# EAGLE design PiHat (EAGLE 9.2.2)

## Sheet 1 of 2
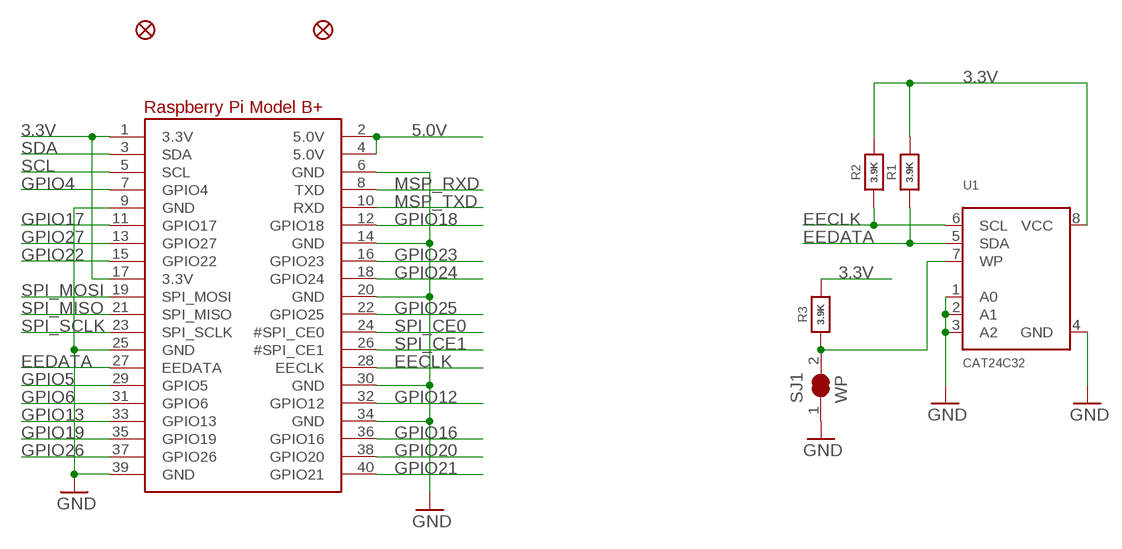
[diagram p0: schematic, sheet 1]

### Parts
FID2  FIDUCIAL""  [FIDUCIAL_1MM]
FID3  FIDUCIAL""  [FIDUCIAL_1MM]
R1  3.9K  RESISTOR0805_NOOUTLINE  [0805-NO]
R2  3.9K  RESISTOR0805_NOOUTLINE  [0805-NO]
R3  3.9K  RESISTOR0805_NOOUTLINE  [0805-NO]
RPI1  RASPBERRYPI_BPLUS_HATNOSLOTS  [PI_HAT_NOSLOTS]
SJ1  WP  SOLDERJUMPER_CLOSED  [SOLDERJUMPER_CLOSEDWIRE]
U1  CAT24C32  EEPROM_I2C_SOIC8_GENERIC  [SOIC8_150MIL]

### Nets
3.3V: R1.2 R2.2 R3.2 RPI1.1(3.3V) RPI1.17(3.3V) U1.8(VCC)
5.0V: RPI1.2(5.0V) RPI1.4(5.0V) ; also sheet 2
EECLK: R2.1 RPI1.28(EECLK) U1.6(SCL)
EEDATA: R1.1 RPI1.27(EEDATA) U1.5(SDA)
GND: RPI1.6(GND) RPI1.9(GND) RPI1.14(GND) RPI1.20(GND) RPI1.25(GND) RPI1.30(GND) RPI1.34(GND) RPI1.39(GND) SJ1.1 U1.1(A0) U1.2(A1) U1.3(A2) U1.4(GND) ; also sheet 2
GPIO4: RPI1.7(GPIO4)
GPIO5: RPI1.29(GPIO5)
GPIO6: RPI1.31(GPIO6)
GPIO12: RPI1.32(GPIO12)
GPIO13: RPI1.33(GPIO13)
GPIO16: RPI1.36(GPIO16) ; also sheet 2
GPIO17: RPI1.11(GPIO17) ; also sheet 2
GPIO18: RPI1.12(GPIO18) ; also sheet 2
GPIO19: RPI1.35(GPIO19) ; also sheet 2
GPIO20: RPI1.38(GPIO20)
GPIO21: RPI1.40(GPIO21)
GPIO22: RPI1.15(GPIO22)
GPIO23: RPI1.16(GPIO23)
GPIO24: RPI1.18(GPIO24) ; also sheet 2
GPIO25: RPI1.22(GPIO25) ; also sheet 2
GPIO26: RPI1.37(GPIO26) ; also sheet 2
GPIO27: RPI1.13(GPIO27) ; also sheet 2
MSP_RXD: RPI1.8(TXD) ; also sheet 2
MSP_TXD: RPI1.10(RXD) ; also sheet 2
N$16: R3.1 SJ1.2 U1.7(WP)
SCL: RPI1.5(SCL)
SDA: RPI1.3(SDA)
SPI_CE0: RPI1.24(#SPI_CE0)
SPI_CE1: RPI1.26(#SPI_CE1)
SPI_MISO: RPI1.21(SPI_MISO)
SPI_MOSI: RPI1.19(SPI_MOSI)
SPI_SCLK: RPI1.23(SPI_SCLK)

## Sheet 2 of 2
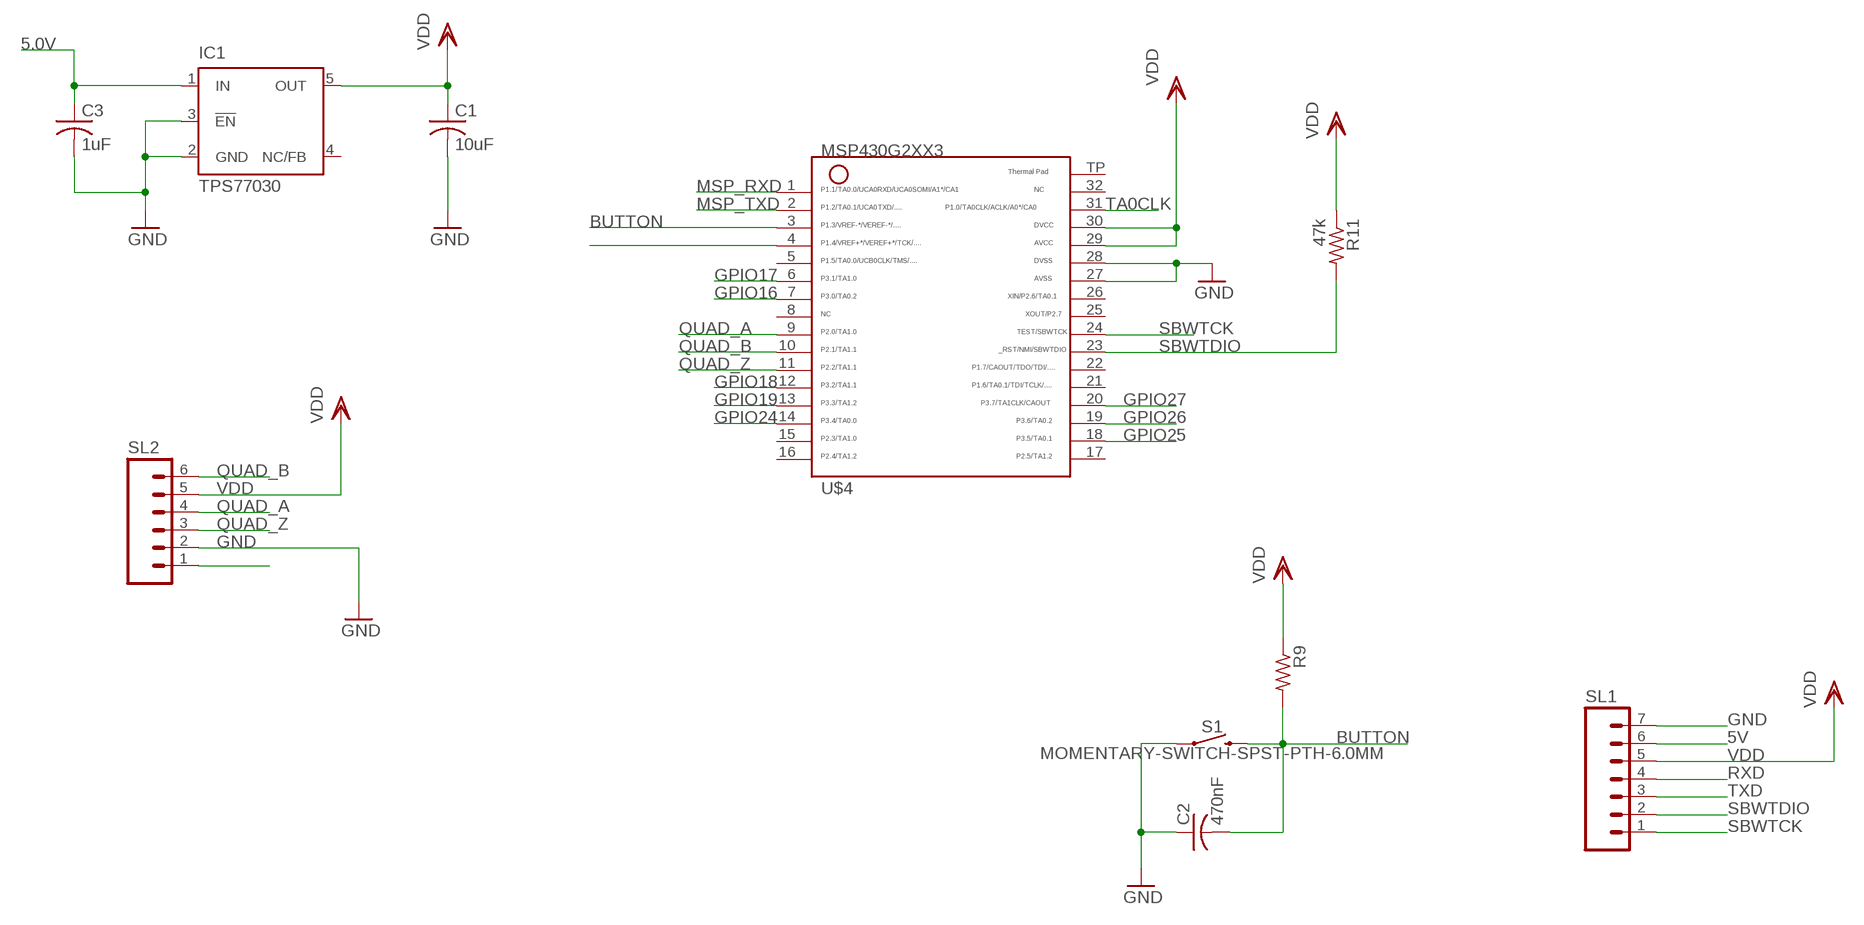
[diagram p1: schematic, sheet 2]

### Parts
C1  10uF  C-USC1206  [C1206]
C2  470nF  C-USC1206  [C1206]
C3  1uF  C-USC0603  [C0603]
IC1  TPS77030  [SOT23-DBV]
R9  R-US_R1206  [R1206]
R11  47k  R-US_R1206  [R1206]
S1  MOMENTARY-SWITCH-SPST-PTH-6.0MM  [TACTILE_SWITCH_PTH_6.0MM]
SL1  M07  [07P]
SL2  M06  [06P]
U$4  G2XX3---RHB32  [RHB32]

### Nets
5.0V: C3.1 IC1.1(IN) ; also sheet 1
5V: SL1.6
BUTTON: C2.2 R9.2 S1.3 U$4.3
GND: C1.2 C2.1 C3.2 IC1.2(GND) IC1.3(!EN) S1.1 SL1.7 SL2.2 U$4.27 U$4.28 ; also sheet 1
GPIO16: U$4.7 ; also sheet 1
GPIO17: U$4.6 ; also sheet 1
GPIO18: U$4.12 ; also sheet 1
GPIO19: U$4.13 ; also sheet 1
GPIO24: U$4.14 ; also sheet 1
GPIO25: U$4.18 ; also sheet 1
GPIO26: U$4.19 ; also sheet 1
GPIO27: U$4.20 ; also sheet 1
MSP_RXD: U$4.1 ; also sheet 1
MSP_TXD: U$4.2 ; also sheet 1
N$6: SL2.1
N$24: U$4.4
QUAD_A: SL2.4 U$4.9
QUAD_B: SL2.6 U$4.10
QUAD_Z: SL2.3 U$4.11
RXD: SL1.4
SBWTCK: SL1.1 U$4.24
SBWTDIO: R11.2 SL1.2 U$4.23
TA0CLK: U$4.31
TXD: SL1.3
VDD: C1.1 IC1.5(OUT) R9.1 R11.1 SL1.5 SL2.5 U$4.29 U$4.30
Unconnected: IC1.4(NC/FB) U$4.5 U$4.8 U$4.15 U$4.16 U$4.17 U$4.21 U$4.22 U$4.25 U$4.26 U$4.32 U$4.TP

## Library data of the parts
C1-C3 = rcl:C-US: CAPACITOR, American symbol; SPICEPREFIX: C
FID2 FID3 = microbuilder:FIDUCIAL: Fiducial Alignment Points Various fiducial points for machine vision alignment.; BOM: EXCLUDE
IC1 = texas:TPS770*: ULTRALOW-POWER 50-mA LOW-DROPOUT LINEAR REGULATORS 50-mA Low-Dropout Regulator Source: http://focus.ti.com/lit/ds/symlink/tps77001.pdf; MF: TEXAS INSTRUMENTS; MPN: TPS77030DBVT; OC_FARNELL: 1207348; OC_NEWARK: 77C1185
R1-R3 = microbuilder:RESISTOR: Resistors For new designs, use the packages preceded by an '_' character since they are more reliable: The following footprints should be used on most boards: _0402 - Standard footprint for regular board layouts _0603 - Standard footprint for regular board layouts _0805 - Standard footprint for regular board layouts _1206 - Standard footprint for regular board layouts For extremely tight-pitch boards where space is at a premium, the following 'micro-pitch' footprints can be used (smaller pads, no silkscreen outline, etc.): _0402MP - Micro-pitch footprint for very dense/compact boards _0603MP - Micro-pitch footprint for very dense/compact boards _0805MP - Micro-pitch footprint for very dense/compact boards _1206MP - Micro-pitch footprint for very dense/compact boards
R9 R11 = rcl:R-US_: RESISTOR, American symbol; SPICEPREFIX: R
RPI1 = microbuilder:RASPBERRYPI_BPLUS
S1 = SparkFun-Switches:MOMENTARY-SWITCH-SPST: Momentary Switch (Pushbutton) - SPST Normally-open (NO) SPST momentary switches (buttons, pushbuttons). Variants PTH-12MM - 12mm square, through-hole Momentary Pushbutton Switch - 12mm Square <https://www.sparkfun.com/products/9190> (COM-09190) PTH-6.0MM, PTH-6.0MM-KIT - 6.0mm square, through-hole Mini Pushbutton Switch <https://www.sparkfun.com/products/97> (COM-00097) KIT package intended for soldering kit's - only one side of pads' copper is exposed. PTH-RIGHT-ANGLE-KIT - Right-angle, through-hole Right Angle Tactile Button <https://www.sparkfun.com/products/10791> - Used on SparkFun BigTime Watch Kit <https://www.sparkfun.com/products/11734> SMD-12MM - 12mm square, surface-mount Tactile Button - SMD (12mm) <https://www.sparkfun.com/products/12993> (COM-12993) Used on SparkFun PicoBoard <https://www.sparkfun.com/products/11888> SMD-4.5MM - 4.5mm Square Trackball Switch Used on SparkFun Blackberry Trackballer Breakout <https://www.sparkfun.com/products/13169> SMD-4.6MMX2.8MM - 4.60mm x 2.80mm, surface mount Used on SparkFun SAMD21 Mini Breakout <https://www.sparkfun.com/products/13664> SMD-5.2MM, SMD-5.2-REDUNDANT - 5.2mm square, surface-mount Mini Pushbutton Switch - SMD <https://www.sparkfun.com/products/8720> (COM-08720) Used on Arduino Pro Mini <https://www.sparkfun.com/products/11114> REDUNDANT package connects both switch circuits together SMD-6.0X3.5MM - 6.0 x 3.5mm, surface mount Momentary Reset Switch SMD <https://www.sparkfun.com/products/8229> (COM-08229) SMD-6.2MM-TALL - 6.2mm square, surface mount Tactile Button - SMD (6mm) <https://www.sparkfun.com/products/12992> Used on SparkFun Digital Sandbox <https://www.sparkfun.com/products/12651> SMD-RIGHT-ANGLE - Right-angle, surface mount Used on SparkFun Block for Intel® Edison - Arduino <https://www.sparkfun.com/products/13036>; PROD_ID: SWCH-08441; SF_SKU: COM-00097
SJ1 = microbuilder:SOLDERJUMPER_CLOSED: Solder Jumper - Closed These solder jumpers are closed by default CLOSEDWIRE - 10 mil trace between pads that can be cut and resoldered later CLOSEDPERM - 63 mil trace between pads for a permanent connection (used to 'bridge' two signals, a shameless hack for Eagle). Can double as a test point as well (no cream layer)
SL1 = con-amp-quick:M07: AMP QUICK CONNECTOR; OC_FARNELL: unknown; OC_NEWARK: unknown
SL2 = con-amp-quick:M06: AMP QUICK CONNECTOR; OC_FARNELL: unknown; OC_NEWARK: unknown
U1 = microbuilder:EEPROM_I2C_SOIC8_GENERIC: Note: The same pinout is used for many I2C EEPROMs in SOIC8(150mil) from a variety of manufacturers and in various sizes. Examples: 16K (2K x 8 Bit) I2C EEPROM 1.7-5.5V, 400KHz, -40°C-85°C Digikey: CAT24C16WI-GT3CT-ND 256K (32K x 8 Bit) I2C EEPROM 1.7-5.5V, 400KHz, -40°C-85°C Digikey: 24AA256-I/SN-ND
U$4 = TI_MSP430_v16:G2XX3---RHB32: MSP430G2XX1 QFN (RHB) 32 Pin Package

## Board
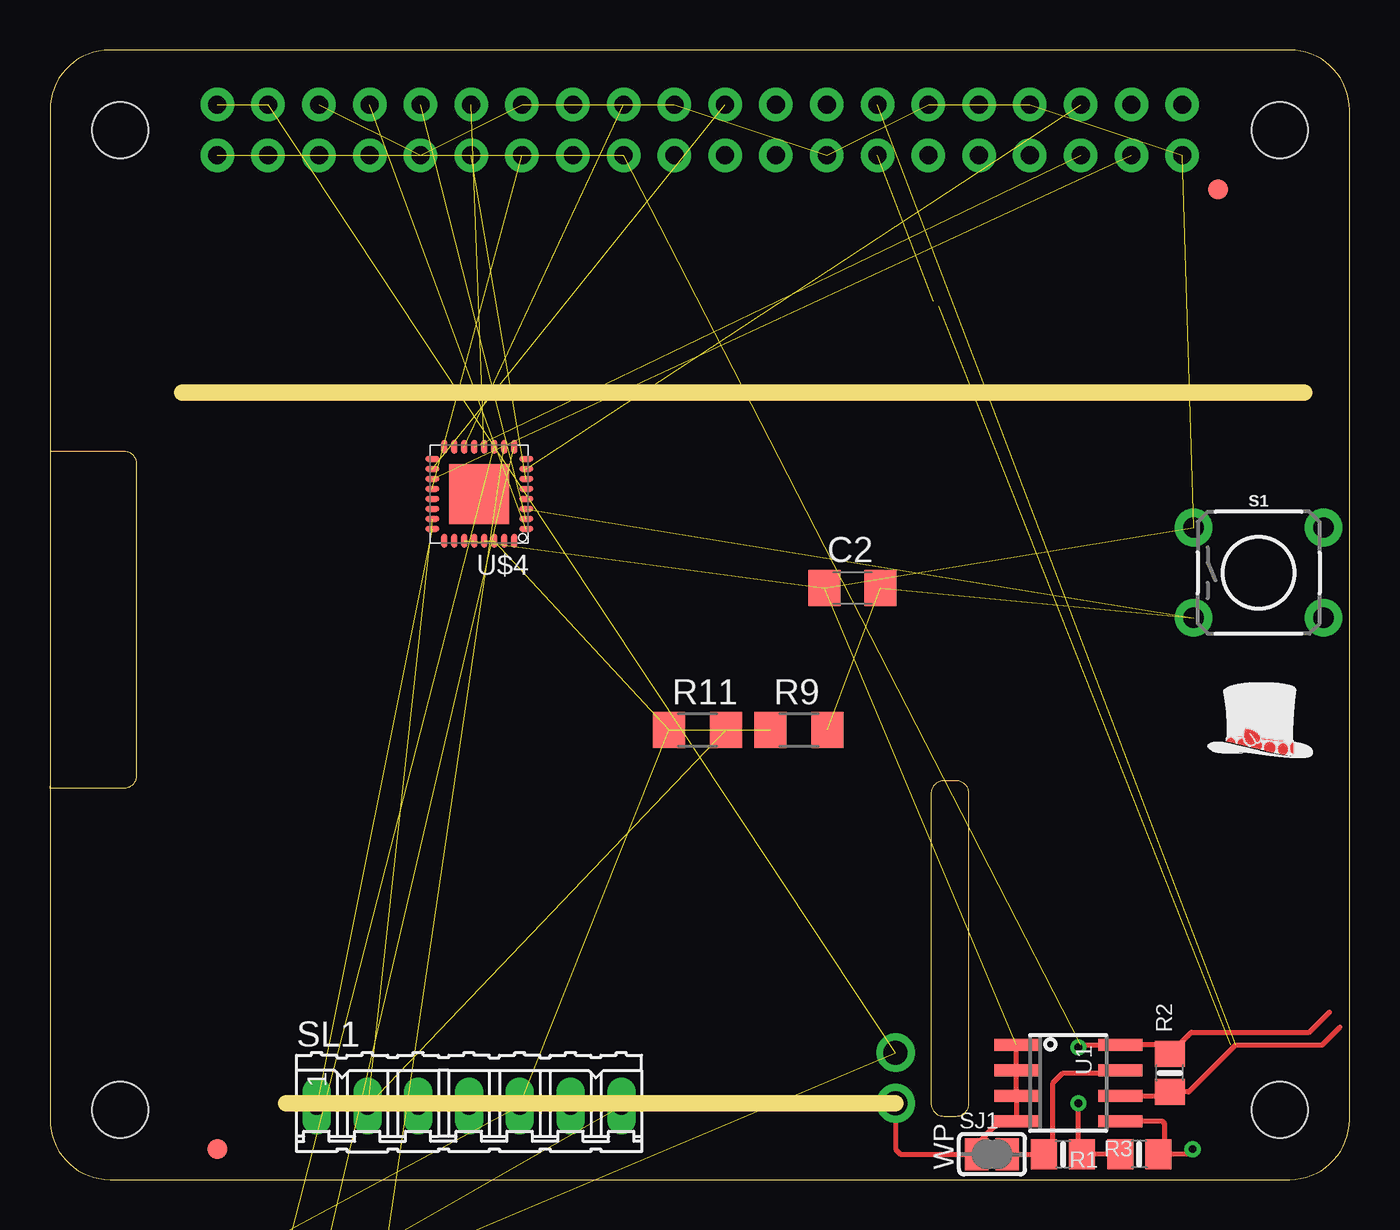
[diagram p2: board, top side]
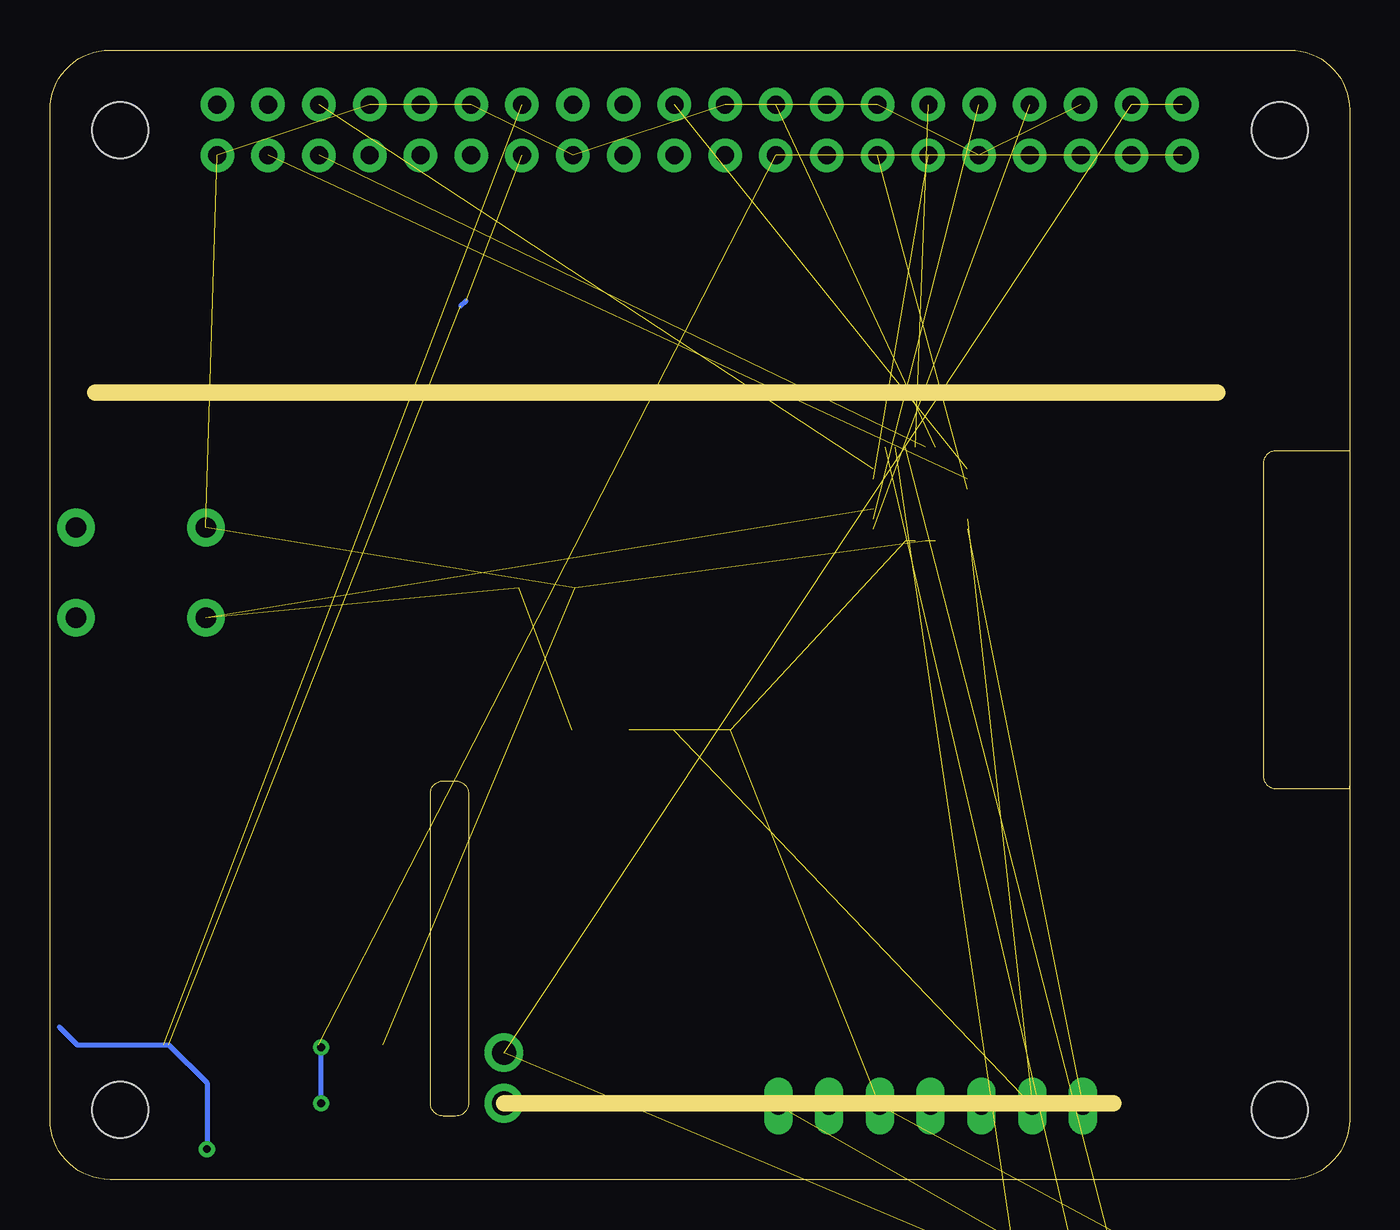
[diagram p3: board, bottom side, seen from below]

Size 65 x 56.5 mm. Coordinates in mm from the lower left corner, seen from the top.
Outline: 0,36.45 3.68,36.45 arc-90 4.32,35.81 4.32,20.19 arc-90 3.68,19.56 0,19.56 0,19.68
Outline: 44.7,3.17 45.34,3.17 arc90 45.97,3.81 45.97,19.3 arc90 45.34,19.94 44.7,19.94 arc90 44.07,19.3 44.07,3.81 arc90 44.7,3.17
Copper layers (1*16): Top 0.035mm / dielectric 1.5mm / Bottom 0.035mm
Design rules "adafruit *": minimum track width 8mil, minimum drill 15.5mil, track to track 8mil, track to pad 8mil, pad to pad 8mil, via to via 8mil, smd to smd 8mil, copper to edge 10mil, drill to drill 8mil, minimum pad ring 10mil, minimum via ring 8mil, stop-mask expansion 2mil, vias tented up to drill 20mil, thermal gap 10mil
Milling: 2 lines

### Footprints (pad centres in the part's own frame; a part is rotated, then mirrored left to right if it is on the bottom)
C1206 = smd 1.6 x 1.8: 1 -1.4,0; 2 1.4,0
C0603 = smd 1.1 x 1: 1 -0.85,0; 2 0.85,0
FIDUCIAL_1MM = smd 1 x 1: 1 0,0
SOT23-DBV = smd 0.55 x 1.2: 1 -0.95,-1.3; 2 0,-1.3; 3 0.95,-1.3; 4 0.95,1.3; 5 -0.95,1.3
0805-NO = smd 1.3 x 1.5: 1 -0.95,0; 2 0.95,0
R1206 = smd 1.6 x 1.803: 1 -1.422,0; 2 1.422,0
PI_HAT_NOSLOTS = drill 0.9 pad 1.676: 1 8.37,51.23; 2 8.37,53.77; 3 10.91,51.23; 4 10.91,53.77; 5 13.45,51.23; 6 13.45,53.77; 7 15.99,51.23; 8 15.99,53.77; 9 18.53,51.23; 10 18.53,53.77; 11 21.07,51.23; 12 21.07,53.77; 13 23.61,51.23; 14 23.61,53.77; 15 26.15,51.23; 16 26.15,53.77; 17 28.69,51.23; 18 28.69,53.77; 19 31.23,51.23; 20 31.23,53.77; 21 33.77,51.23; 22 33.77,53.77; 23 36.31,51.23; 24 36.31,53.77; 25 38.85,51.23; 26 38.85,53.77; 27 41.39,51.23; 28 41.39,53.77; 29 43.93,51.23; 30 43.93,53.77; 31 46.47,51.23; 32 46.47,53.77; 33 49.01,51.23; 34 49.01,53.77; 35 51.55,51.23; 36 51.55,53.77; 37 54.09,51.23; 38 54.09,53.77; 39 56.63,51.23; 40 56.63,53.77 | hole 2.8: 3.5,3.5; 3.5,52.5; 61.5,52.5; 61.5,3.5
TACTILE_SWITCH_PTH_6.0MM = drill 1.016 pad 1.88: 1 -3.251,2.261; 2 3.251,2.261; 3 -3.251,-2.261; 4 3.251,-2.261
SOLDERJUMPER_CLOSEDWIRE = smd 1.168 x 1.6: 1 -0.762,0; 2 0.762,0 | smd 0.635 x 0.203: WIRE 0,0
07P = drill 0.914 long: 1 -7.62,0; 2 -5.08,0; 3 -2.54,0; 4 0,0; 5 2.54,0; 6 5.08,0; 7 7.62,0
06P = drill 0.914 long: 1 -6.35,0; 2 -3.81,0; 3 -1.27,0; 4 1.27,0; 5 3.81,0; 6 6.35,0
SOIC8_150MIL = smd 0.6 x 2.2: 1 -1.905,-2.6; 2 -0.635,-2.6; 3 0.635,-2.6; 4 1.905,-2.6; 5 1.905,2.6; 6 0.635,2.6; 7 -0.635,2.6; 8 -1.905,2.6
RHB32 = smd 0.7 x 0.3: 1 -2.35,1.75; 2 -2.35,1.25; 3 -2.35,0.75; 4 -2.35,0.25; 5 -2.35,-0.25; 6 -2.35,-0.75; 7 -2.35,-1.25; 8 -2.35,-1.75; 17 2.35,-1.75; 18 2.35,-1.25; 19 2.35,-0.75; 20 2.35,-0.25; 21 2.35,0.25; 22 2.35,0.75; 23 2.35,1.25; 24 2.35,1.75 | smd 0.3 x 0.7: 9 -1.75,-2.35; 10 -1.25,-2.35; 11 -0.75,-2.35; 12 -0.25,-2.35; 13 0.25,-2.35; 14 0.75,-2.35; 15 1.25,-2.35; 16 1.75,-2.35; 25 1.75,2.35; 26 1.25,2.35; 27 0.75,2.35; 28 0.25,2.35; 29 -0.25,2.35; 30 -0.75,2.35; 31 -1.25,2.35; 32 -1.75,2.35 | smd 3 x 3: TP 0,0

### Placement (x,y rotation side)
C1  1.52,-17.14 0 top  (outside the outline)
C2  40.13,29.59 0 top
C3  0.51,-20.7 0 top  (outside the outline)
FID2  8.38,1.52 0 top
FID3  58.42,49.53 0 top
IC1  1.4,-10.03 0 top  (outside the outline)
R1  54.48,1.27 180 top
R2  56.01,5.33 90 top
R3  50.67,1.27 0 top
R9  37.47,22.48 0 top
R11  32.38,22.48 0 top
RPI1  0,0 0 top
S1  60.45,30.35 0 top
SJ1  47.12,1.27 0 top
SL1  20.95,3.68 0 top
SL2  6.86,-27.94 0 top  (outside the outline)
U1  50.93,4.83 270 top
U$2  [PIHATLOGO]  57.91,21.08 0 top
U$4  21.46,34.29 180 top

### Tracks (layer width: path | path; a pad name or v marks a point on that pad's centre or on a via)
3.3V  (via drill 0.39)  (2 unrouted)
  Top 0.254: R1.2 R3.2 51.69,1.34 51.44,1.59 v51.44,3.81 | v51.44,6.6 51.56,6.73 U1.8 55.56,6.73 R2.2 57.09,7.37 62.99,7.37 64.01,8.38
  Bottom 0.254: v51.44,3.81 v51.44,6.6
5.0V  (via drill 1.2 pad 1.93)  (4 unrouted)
  other vias: 42.29,6.35
BUTTON  (3 unrouted)
EECLK  (1 unrouted)
  Top 0.254: U1.6 55.81,4.19 R2.1 56.96,4.38 59.31,6.73 63.63,6.73 64.52,7.62
EEDATA  (via drill 0.39)  (2 unrouted)
  Top 0.254: U1.5 55.63,2.92 55.75,2.79 55.75,1.59 R1.1 56.9,1.27 v57.15,1.52
  Bottom 0.254: 44.2,43.94 44.45,43.69 | 64.52,7.62 63.63,6.73 59.05,6.73 57.15,4.83 v57.15,1.52
GND  (via drill 1.2 pad 1.93)  (18 unrouted)
  Top 0.254: U1.1 U1.2 U1.3 U1.4 47.5,2.92 46.1,1.52 SJ1.1 42.55,1.27 42.29,1.52 v42.29,3.81
GPIO16  (1 unrouted)
GPIO17  (1 unrouted)
GPIO18  (1 unrouted)
GPIO19  (1 unrouted)
GPIO24  (1 unrouted)
GPIO25  (1 unrouted)
GPIO26  (1 unrouted)
GPIO27  (1 unrouted)
MSP_RXD  (1 unrouted)
MSP_TXD  (1 unrouted)
N$16
  Top 0.254: SJ1.2 R3.1 50.16,1.71 50.16,4.83 50.67,5.33 53.4,5.33 U1.7
QUAD_A  (1 unrouted)
QUAD_B  (1 unrouted)
QUAD_Z  (1 unrouted)
SBWTCK  (1 unrouted)
SBWTDIO  (2 unrouted)
VDD  (7 unrouted)

### Text on the board
tPlace: WP
tSilk: + | + | + | +